# Altium schematic sheet EFR32xG1x_DISC_WIDEBAND_REF_DES_A00_02_ RF,Antenna&Power_HB_TN.SchDoc
size 420 x 297 mm
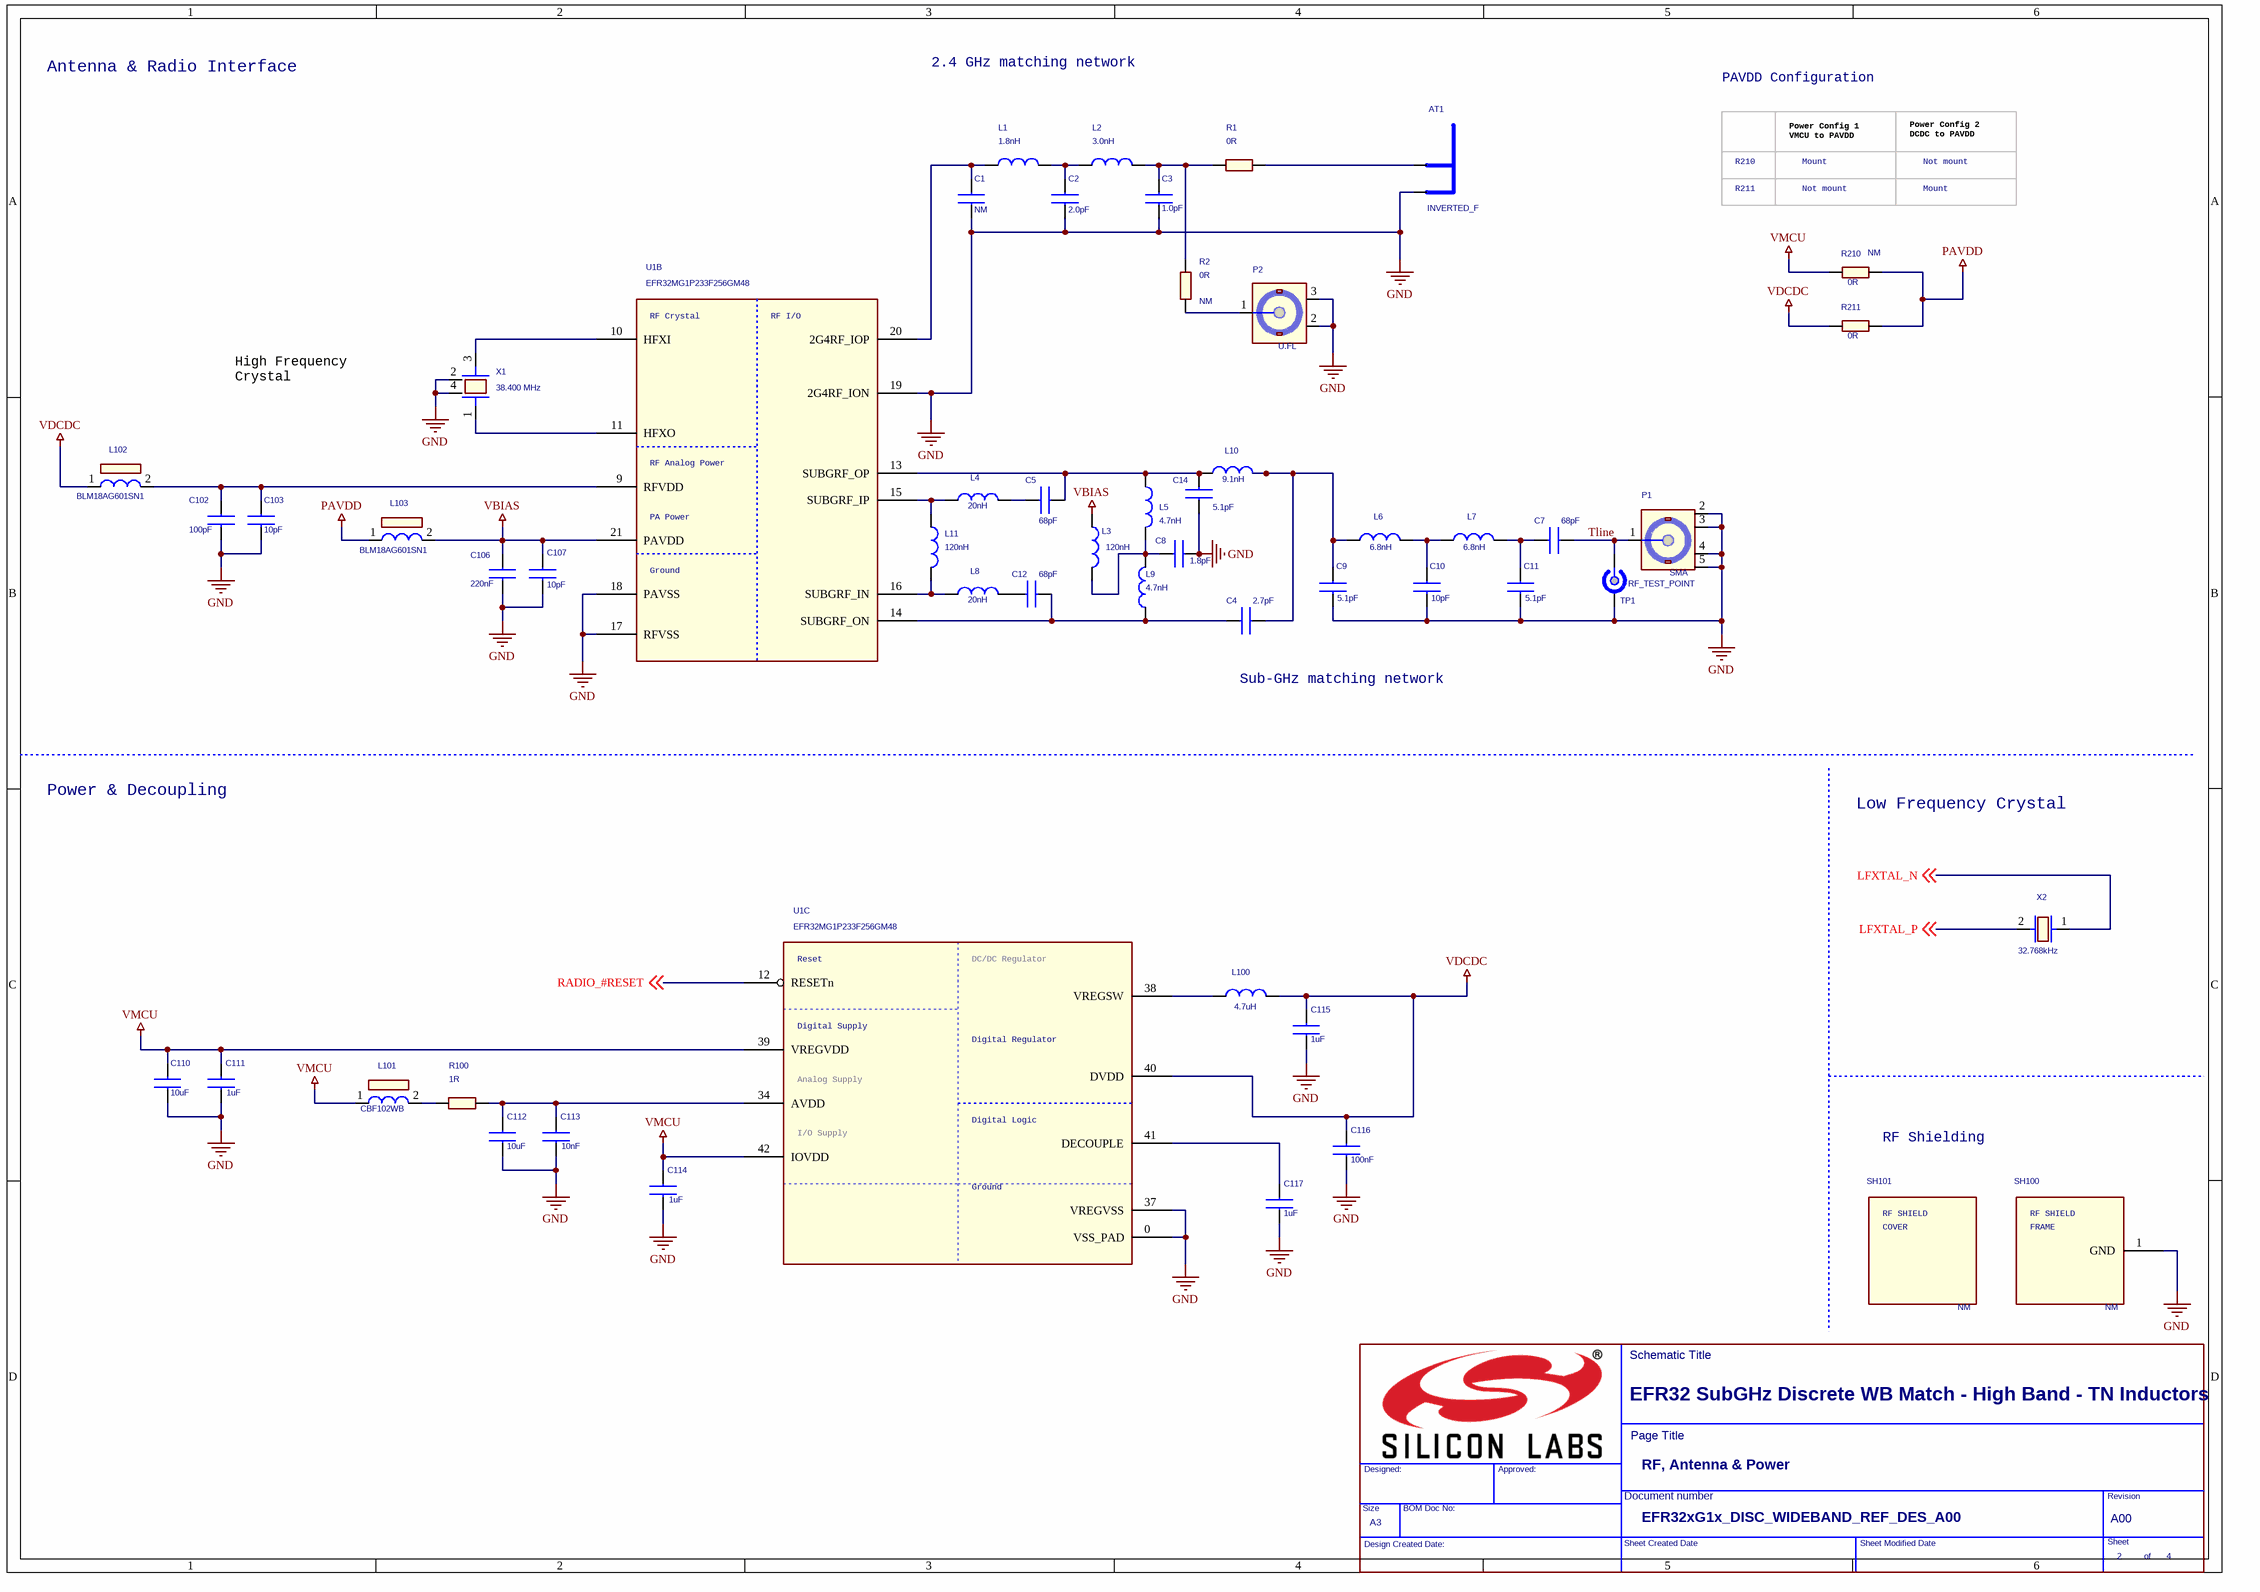
[diagram p0: EFR32xG1x_DISC_WIDEBAND_REF_DES_A00_02_ RF,Antenna&Power_HB_TN.SchDoc]

## Parts
*  Page Title: RF, Antenna & Power  Page Size: A3  RevCode: A00  Title: EFR32 SubGHz Discrete WB Match - High Band - TN Inductors  Doc: EFR32xG1x_DISC_WIDEBAND_REF_DES_A00  Page Number: 2  Page Count: 4  (hidden comment: TitleBlock_EnergyMicro_A3)  (graphical)
AT1  INVERTED_F  [SL_INVERTED_F]  (net tie, no BOM)
C1  NM  [C0201_L]
C2  2.0pF  [C0201_L]
C3  1.0pF  [C0201_L]
C4  2.7pF  [C0201_L]
C5  68pF  [C0201_L]
C7  68pF  [C0201_L]
C8  1.8pF  [C0201_L]
C9  5.1pF  [C0201_L]
C10  10pF  [C0201_L]
C11  5.1pF  [C0201_L]
C12  68pF  [C0201_L]
C14  5.1pF  [C0201_L]
C102  100pF  [C0402_L]
C103  10pF  [C0402_L]
C106  220nF  [C0402_L]
C107  10pF  [C0201_L]
C110  10uF  [C0603_L]
C111  1uF  [C0402_L]
C112  10uF  [C0603_L]
C113  10nF  [C0402_L]
C114  1uF  [C0402_L]
C115  1uF  [C0402_L]
C116  100nF  [C0402_L]
C117  1uF  [C0402_L]
L1  1.8nH  [L0201_L]
L2  3.0nH  [L0201_L]
L3  120nH  [L0201_L]
L4  20nH  [L0201_L]
L5  4.7nH  [L0201_L]
L6  6.8nH  [L0201_L]
L7  6.8nH  [L0201_L]
L8  20nH  [L0201_L]
L9  4.7nH  [L0201_L]
L10  9.1nH  [L0201_L]
L11  120nH  [L0201_L]
L100  4.7uH  [COIL_MUR_LQH3NP_1212]
L101  CBF102WB  [WURTH_CBF_0603]
L102  BLM18AG601SN1  [COIL_MUR_BLM18_0603]
L103  BLM18AG601SN1  [COIL_MUR_BLM18_0603]
P1  SMA  [TE_SMA_TH_1814832]
P2  U.FL  [HIROSE_U.FL-R-SMT-1]
R1  0R  [R0201_L]
R2  0R  Not Mounted: NM  [R0201_L]
R100  1R  [R0402_L]
R210  0R  Not Mounted: NM  [R0402_L]
R211  0R  [R0402_L]
SH100  Not Mounted: NM  [LAIRD_BMI-S-203-F]  (hidden comment: RF_SHIELD_FRAME_BMI-S-203-F)
SH101  Not Mounted: NM  (hidden comment: RF_SHIELD_COVER_BMI-S-203-C)
TP1  RF_TEST_POINT  [TP_INGUN_50_OHM_CLOSED openvia]
U1  EFR32MG1P233F256GM48  [QFN48_M050_SQ7.0_EP_SL_L]  (parts B,C of 3)
X1  38.400 MHz  [X_SSS_DSX211SH_2.05X1.65-4]
X2  32.768kHz  [X_MCS_CM8V-T1A]

## Nets
GND: AT1.2(GND) C1.1 C2.1 C3.1 C8.1 C9.2 C10.2 C11.2 C14.2 C102.2 C103.2 C106.2 C107.2 C110.2 C111.2 C112.2 C113.2 C114.2 C115.2 C116.2 C117.2 P1.2(GND1) P1.3(GND2) P1.4(GND3) P1.5(GND4) P2.2(GND1) P2.3(GND4) SH100.1(GND) TP1.2(GND) U1.0(VSS_PAD) U1.17(RFVSS) U1.18(PAVSS) U1.19(2G4RF_ION) U1.37(VREGVSS) X1.2 X1.4
PAVDD: L103.1 R210.1 R211.1
VBIAS: C106.1 C107.1 L3.2 L103.2 U1.21(PAVDD)
VDCDC: C115.1 C116.1 L100.2 L102.1 R211.2 U1.40(DVDD)
VMCU: C110.1 C111.1 C114.1 L101.1 R210.2 U1.39(VREGVDD) U1.42(IOVDD)
LFXTAL_N: X2.1 ; off-sheet LFXTAL_N
LFXTAL_P: X2.2 ; off-sheet LFXTAL_P
RADIO_#RESET: U1.12(RESETn) ; off-sheet RADIO_#RESET
Tline: C7.2 P1.1(SIGNAL) TP1.1(RF)
NetAT1_1: AT1.1(ANT) R1.2
NetC1_2: C1.2 L1.1 U1.20(2G4RF_IOP)
NetC2_2: C2.2 L1.2 L2.1
NetC3_2: C3.2 L2.2 R1.1 R2.1
NetC4_1: C4.1 C12.2 L9.2 U1.14(SUBGRF_ON)
NetC4_2: C4.2 C9.1 L6.2 L10.1
NetC5_1: C5.1 L4.1
NetC5_2: C5.2 C14.1 L5.2 L10.2 U1.13(SUBGRF_OP)
NetC7_1: C7.1 C11.1 L7.1
NetC8_2: C8.2 L3.1 L5.1 L9.1
NetC10_1: C10.1 L6.1 L7.2
NetC12_1: C12.1 L8.1
NetC102_1: C102.1 C103.1 L102.2 U1.9(RFVDD)
NetC112_1: C112.1 C113.1 R100.2 U1.34(AVDD)
NetC117_1: C117.1 U1.41(DECOUPLE)
NetL4_2: L4.2 L11.2 U1.15(SUBGRF_IP)
NetL8_2: L8.2 L11.1 U1.16(SUBGRF_IN)
NetL100_1: L100.1 U1.38(VREGSW)
NetL101_2: L101.2 R100.1
NetP2_1: P2.1(SIGNAL) R2.2
NetU1_10: U1.10(HFXI) X1.3
NetU1_11: U1.11(HFXO) X1.1

## Notes on the sheet
- Antenna & Radio Interface
- 2.4 GHz matching network
- PAVDD Configuration
- R210
- R211
- Power Config 1
  VMCU to PAVDD
- Not mount
- Mount
- Power Config 2
  DCDC to PAVDD
- High Frequency
  Crystal
- Sub-GHz matching network
- Power & Decoupling
- Low Frequency Crystal
- (near SH101) RF Shielding
- (in symbol EFR32-DUALBAND-QFN48, part B) RF Crystal; RF I/O; RF Analog Power; PA Power; Ground
- (in symbol EFR32-DUALBAND-QFN48, part C) Reset; DC/DC Regulator; Digital Supply; Digital Regulator; Analog Supply; Digital Logic; I/O Supply; Ground
- (in symbol RF_SHIELD_COVER_BMI-S-203-C) RF SHIELD; COVER
- (in symbol RF_SHIELD_FRAME_BMI-S-203-F) RF SHIELD; FRAME
- (in symbol TitleBlock_EnergyMicro_A3) Schematic Title; Page Title; Designed:; Approved:; Document number; Revision; Size; BOM Doc No:; Sheet; Design Created Date:; Sheet Created Date; Sheet Modified Date; of

## Library data of the parts
AT1 = ANT_INVERTED_F
C1 = C0402: Manufacturer Part Number: GRM0335 Series; Manufacturer: Murata; Tolerance: ±0.05P; Technology: C0G
C2-C4 C8 C14 = C0402: Manufacturer Part Number: GRM0335 Series; Manufacturer: Murata; Tolerance: ±0.05pF; Technology: C0G
C5 C7 C12 = C0402: Manufacturer Part Number: GRM0335 Series; Manufacturer: Murata; Tolerance: ±5%; Technology: C0G
C9 C11 = C0402: Manufacturer Part Number: GRM0335 Series; Manufacturer: Murata; Tolerance: ±0.1pF; Technology: C0G
C10 = C0402: Manufacturer Part Number: GRM0335 Series; Manufacturer: Murata; Tolerance: ±0.25pF; Technology: C0G
C102 C103 C107 = C0402: Tolerance: 5%; Rating: 50V; Technology: C0G
C106 C113 C116 = C0402: Tolerance: 10%; Rating: 16V; Technology: X7R
C110 C112 = C0603: Tolerance: 20%; Rating: 6.3V; Technology: X5R
C111 C114 C115 C117 = C0402: Tolerance: 10%; Rating: 25V; Technology: X5R
L1 L2 = L0402: Manufacturer Part Number: LQP03TN Series; Manufacturer: Murata; Tolerance: ±0.05nH
L3 L11 = L0402: Manufacturer Part Number: LQP03TN Series; Manufacturer: Murata; Tolerance: ±5%
L4 L5 L8-L10 = L0402: Manufacturer Part Number: LQP03TN Series; Manufacturer: Murata; Tolerance: ±0.1nH
L6 L7 = L0402: Manufacturer Part Number: LQP03TN Series; Manufacturer: Murata; Tolerance: ±2%
L100 = LQH3NP: Mfg #: LQH3NPN4R7MM0L; Mfg: Murata
L101 = CBF102WB: Mfg #: 74279266; Mfg: Würth Electronics; Price_1K: 0.031
L102 L103 = BLM18AG: Mfg #: BLM18AG601SN1D; Mfg: Murata; Price_1K: 0.027
P1 = SMA_TH: Mfg: TE Connectivity; Mfg #: 5-1814832-1; Price_1K: 1.46
P2 = HIROSE_U.FL: Mfg #: U.FL-R-SMT-1; Mfg: Hirose; Price_1K: 0.70
R1 R2 R100 R210 R211 = R0402: Price_1K: 0.005
SH100 = RF_SHIELD_FRAME_BMI-S-203-F: Mfg: Laird Technologies; Footprint: Laird_BMI-S-203-F; Mfg #: BMI-S-203-F; Price_1k: 1.148
SH101 = RF_SHIELD_COVER_BMI-S-203-C: Mfg: Laird Technologies; Price_1k: 0.814; Mfg #: BMI-S-203-C
TP1 = TP_RF
U1 = EFR32-DUALBAND-QFN48: Manufacturer Part Number: EFR32MG1P233F256GM48-B0; Manufacturer: Silicon Labs
X1 = DSX211SH: Manufacturer Part Number: DSX211SH 1ZZNAE38400AB0A; Manufacturer: KDS; Tolerance: ±20ppm; Price_1K: 0.512
X2 = CM8V-T1A: Manufacturer: Micro Crystal AG; Tolerance: ±20ppm; Price_1K: 0.3